# EAGLE design MUV_Sensors_pcb_all (EAGLE 9.1.3)

## Sheet 1 of 2
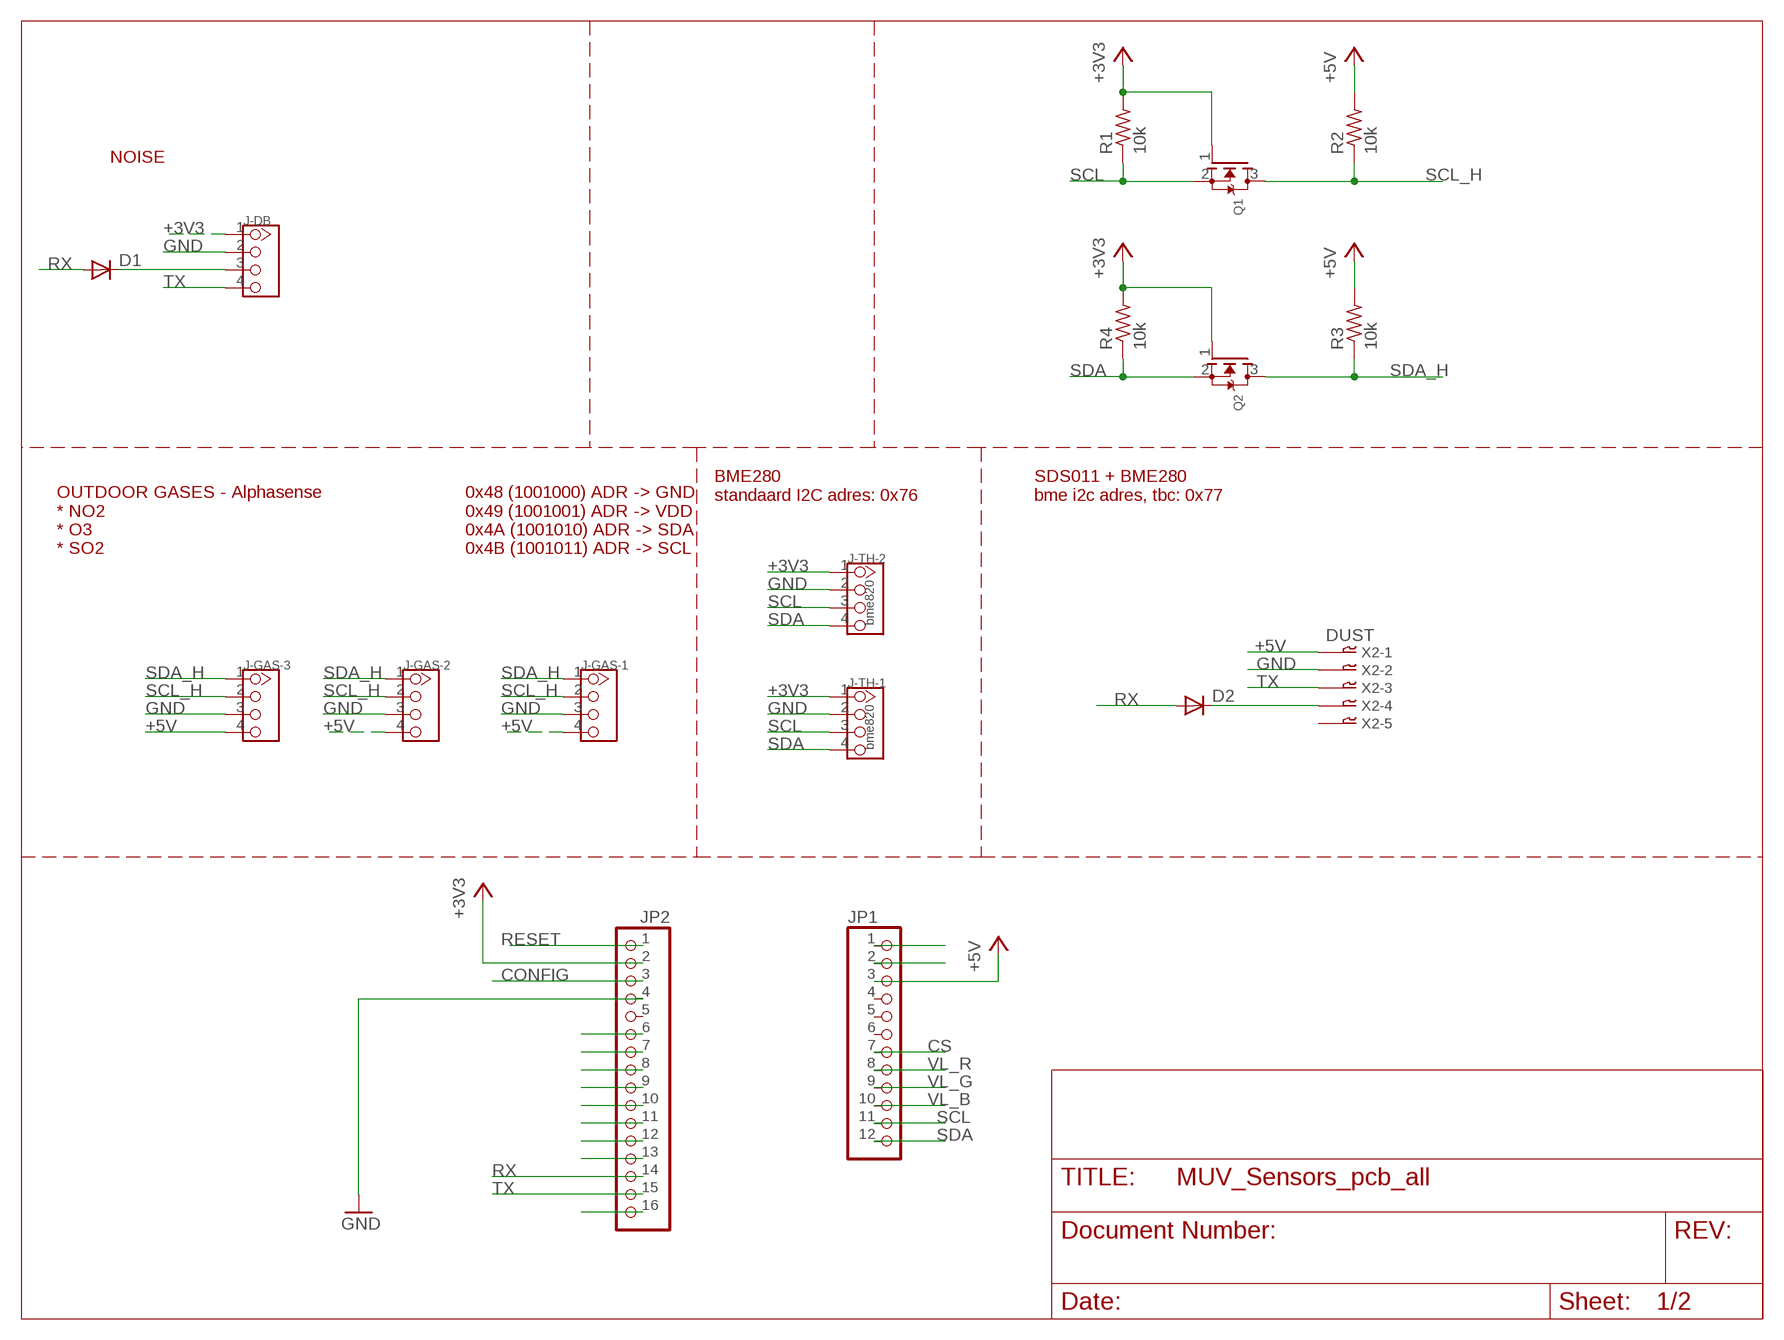
[diagram p0: schematic, sheet 1]

### Parts
D1  DIODE-DO214AA  [DO214AA]
D2  DIODE-DO214AA  [DO214AA]
J-DB  TWIG-4P-2.0-2.0  [4P-2.0]
J-GAS-1  TWIG-4P-2.0-2.0  [4P-2.0]
J-GAS-2  TWIG-4P-2.0-2.0  [4P-2.0]
J-GAS-3  TWIG-4P-2.0-2.0  [4P-2.0]
J-TH-1  bme820  TWIG-4P-2.0-2.0  [4P-2.0]
J-TH-2  bme820  TWIG-4P-2.0-2.0  [4P-2.0]
JP1  HEADER-1X12OVAL  [1X12_OVAL]
JP2  HEADER-1X16  [1X16_OVAL]
Q1  MOSFET-NWIDE  [SOT23-WIDE]
Q2  MOSFET-NWIDE  [SOT23-WIDE]
R1  10k  RESISTOR1206  [1206]
R2  10k  RESISTOR1206  [1206]
R3  10k  RESISTOR1206  [1206]
R4  10k  RESISTOR1206  [1206]
X2  DUST  05-JST-B5B-XH-A  [B5B-XH]

### Nets
+3V3 [power]: J-DB.1 J-TH-1.1 J-TH-2.1 JP2.2 Q1.1(G) Q2.1(G) R1.2 R4.2
+5V [power_5V]: J-GAS-1.4 J-GAS-2.4 J-GAS-3.4 JP1.3 R2.2 R3.2 X2.P$1
CONFIG: JP2.3
CS: JP1.7
GND [power]: J-DB.2 J-GAS-1.3 J-GAS-2.3 J-GAS-3.3 J-TH-1.2 J-TH-2.2 JP2.4 X2.P$2
N$1: JP1.1
N$2: JP1.2
N$3: D1.C J-DB.3
N$4: D2.C X2.P$4
N$13: JP2.6
N$14: JP2.7
N$17: JP2.8
N$18: JP2.9
N$19: JP2.10
N$20: JP2.11
N$21: JP2.12
N$22: JP2.13
N$23: JP2.16
RESET: JP2.1
RX: D1.A D2.A JP2.14
SCL: J-TH-1.3 J-TH-2.3 JP1.11 Q1.2(S) R1.1
SCL_H: J-GAS-1.2 J-GAS-2.2 J-GAS-3.2 Q1.3(D) R2.1
SDA: J-TH-1.4 J-TH-2.4 JP1.12 Q2.2(S) R4.1
SDA_H: J-GAS-1.1 J-GAS-2.1 J-GAS-3.1 Q2.3(D) R3.1
TX: J-DB.4 JP2.15 X2.P$3
VL_B: JP1.10
VL_G: JP1.9
VL_R: JP1.8
Unconnected: JP1.4 JP1.5 JP1.6 JP2.5 X2.P$5

### Notes on the sheet
- NOISE
- BME280
  standaard I2C adres: 0x76
- SDS011 + BME280
  bme i2c adres, tbc: 0x77
- OUTDOOR GASES - Alphasense
  * NO2
  * O3
  * SO2
- 0x48 (1001000) ADR -> GND
  0x49 (1001001) ADR -> VDD
  0x4A (1001010) ADR -> SDA
  0x4B (1001011) ADR -> SCL

## Sheet 2 of 2

## Library data of the parts
D1 D2 = diode:DIODE-: DIODE
J-DB J-GAS-1-J-GAS-3 J-TH-1 J-TH-2 = Connector:TWIG-4P-2.0
JP1 = headers:HEADER-1X12
JP2 = headers:HEADER-1X16: PIN HEADER
Q1 Q2 = microbuilder:MOSFET-N: N-Channel Mosfet LEGEND VDS: Voltage Drain-Source ID: Drain Current RDS(ON): Drain-Source On-State Resistance VGS(TH): Gate-Source Threshold Voltage CISS: Drain-Source Input Capacitance SOT-23 Name VDS ID RDS(ON) VGS(TH) CISS Order Number 2N7002E 60V 260mA 2.5 Ohm 2.5V @ 250uA 26.7pF @ 25V 2N7002ET1GOSTR-ND BSH103 30V 850mA 400 mOhm 400mV @ 1mA 83pF @ 24V BSH103,235-ND BSS138 60V 320mA 1.6 Ohm 1.5V @ 250uA 50pF @ 10V Mouser: 771-BSS138PW115 DMN2075U-7 20V 4.2A 38 mOhm 1V @ 250 uA 594.3pF @ 10V DMN2075U-7DICT-ND * BSS138 good choice for I2C level-shifting
R1-R4 = ng:RESISTOR
X2 = bt_con-jst-xh:05-JST: JST CONNECTOR

## Net classes
0 default: width 0.3 mm, clearance 0.4 mm
1 power: width 0.3 mm, clearance 0.4 mm
2 power_5V: width 1 mm

## Board
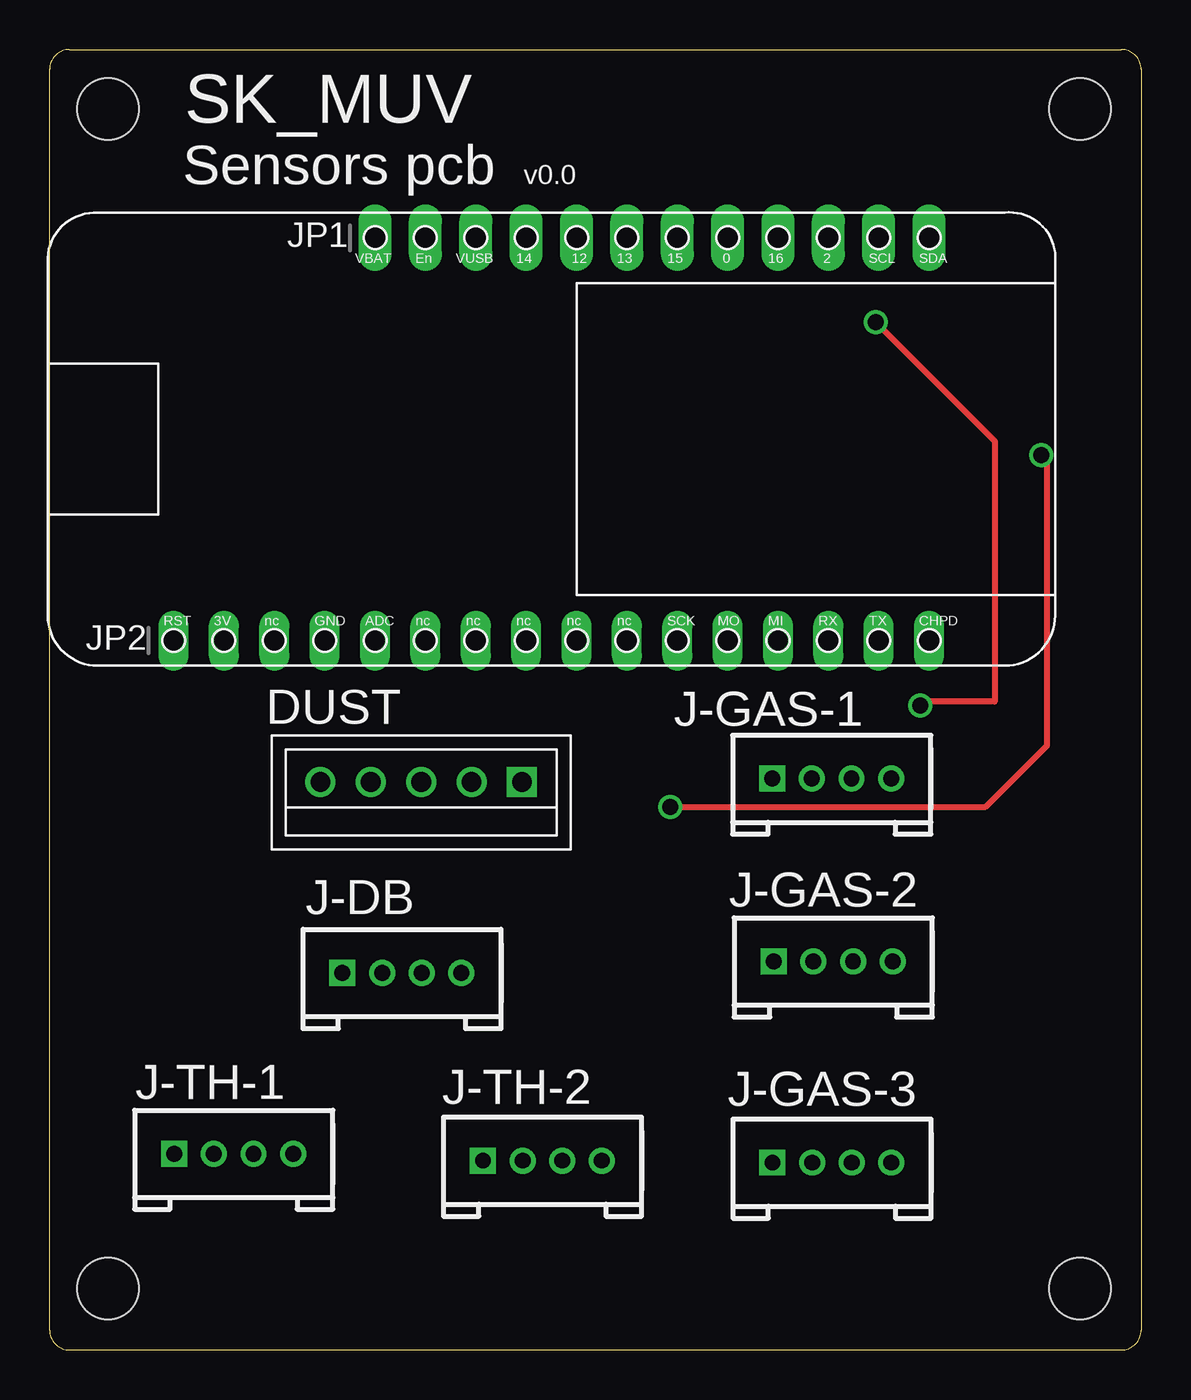
[diagram p1: board, top side]
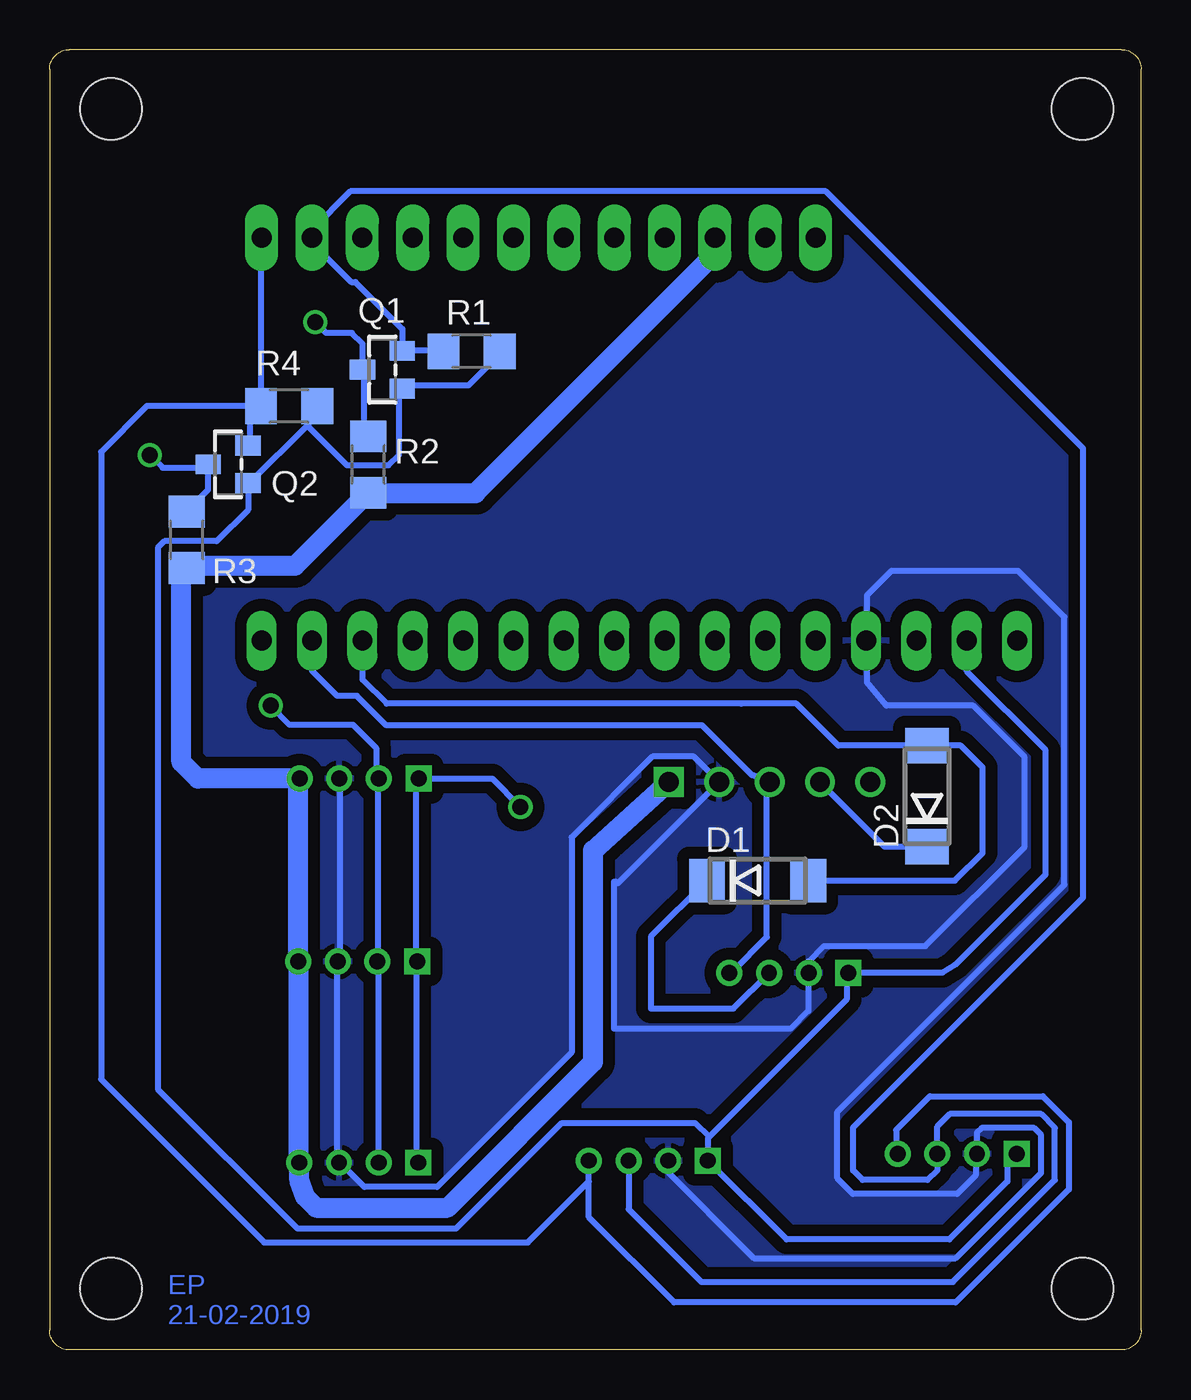
[diagram p2: board, bottom side, seen from below]

Size 55.05 x 65.6 mm. Coordinates in mm from the lower left corner, seen from the top.
Outline: 0,1 arc90 1,0 54.05,0 arc90 55.05,1 55.05,64.6 arc90 54.05,65.6 1,65.6 arc90 0,64.6 0,1
Copper layers (1*16): Top 0.035mm / dielectric 1.5mm / Bottom 0.035mm
Design rules "default *": minimum track width 6mil, minimum drill 0.35mm, track to track 0.4mm, track to pad 0.4mm, pad to pad 0.4mm, via to via 0.4mm, smd to smd 0.4mm, copper to edge 40mil, drill to drill 6mil, minimum pad ring 10mil, minimum via ring 8mil, stop-mask expansion 4mil, vias tented up to drill 0mil, thermal gap 10mil
Holes 3.1 mm at 2.95,62.6 51.95,62.6 51.95,3.1 2.95,3.1

### Footprints (pad centres in the part's own frame; a part is rotated, then mirrored left to right if it is on the bottom)
DO214AA = smd 1.8 x 2.2: A 2.55,0; C -2.55,0
4P-2.0 = drill 0.8 pad 1.27 square: 1 -3,0 | drill 0.8 pad 1.27: 2 -1,0; 3 1,0; 4 3,0
1X12_OVAL = drill 1.016 pad 1.676 long: 1 -13.97,0; 2 -11.43,0; 3 -8.89,0; 4 -6.35,0; 5 -3.81,0; 6 -1.27,0; 7 1.27,0; 8 3.81,0; 9 6.35,0; 10 8.89,0; 11 11.43,0; 12 13.97,0
1X16_OVAL = drill 1 long: 1 -19.05,0; 2 -16.51,0; 3 -13.97,0; 4 -11.43,0; 5 -8.89,0; 6 -6.35,0; 7 -3.81,0; 8 -1.27,0; 9 1.27,0; 10 3.81,0; 11 6.35,0; 12 8.89,0; 13 11.43,0; 14 13.97,0; 15 16.51,0; 16 19.05,0
SOT23-WIDE = smd 1 x 1.27: 1 -0.95,-1; 2 0.95,-1; 3 0,1
1206 = smd 1.6 x 1.803: 1 -1.422,0; 2 1.422,0
B5B-XH = drill 1 square: P$1 -5.08,0 | drill 1: P$2 -2.54,0; P$3 0,0; P$4 2.54,0; P$5 5.08,0

### Placement (x,y rotation side)
D1  19.34,23.68 0 bottom
D2  10.8,27.93 90 bottom
J-DB  17.77,19.02 0 top
J-GAS-1  39.44,28.82 0 top
J-GAS-2  39.52,19.6 0 top
J-GAS-3  39.45,9.45 0 top
J-TH-1  9.28,9.9 0 top
J-TH-2  24.85,9.55 0 top
JP1  30.38,56.1 0 top
JP2  25.3,35.78 0 top
Q1  38.27,49.45 90 bottom
Q2  46.04,44.68 90 bottom
R1  33.77,50.38 0 bottom
R2  38.98,44.66 270 bottom
R3  48.14,40.87 270 bottom
R4  42.97,47.62 0 bottom
U1  [ADA_FEATHER_HUZZAH_ESP8266_NOPADS]  -0.1,34.51 0 top
X2  18.74,28.65 180 top

### Tracks (layer width: path | path; a pad name or v marks a point on that pad's centre or on a via)
+3V3
  Bottom 0.3: 21.79,10.74 14.85,17.68 14.85,18.9 J-DB.1 10.03,19.02 9.38,19.42 4.82,23.98 4.82,30.26 8.79,34.23 JP2.2 | 21.79,10.74 21.85,10.68 J-TH-2.1 17.88,5.58 9.68,5.58 6.75,8.5 6.75,9.43 J-TH-1.1 | R1.2 32.35,50.23 33.93,48.65 37.25,48.65 Q1.1 37.43,48.48 37.43,45.15 37.95,44.63 40.05,44.63 42.07,46.64 | 42.07,46.64 41.63,47.08 41.63,47.6 R4.2 | 42.07,46.64 44.95,43.75 Q2.1 45.04,42.37 46.62,40.8 49.27,40.8 49.59,40.47 49.59,13.16 42.56,6.13 34.54,6.13 29.22,11.45 22.5,11.45 21.79,10.74
+5V
  Bottom 1: X2.P$1 27.63,25.2 27.63,14.52 34.98,7.18 41.6,7.18 42.16,7.73 42.45,8.55 J-GAS-3.4 42.5,9.45 42.5,19.6 J-GAS-2.4 42.5,19.95 42.5,28.7 J-GAS-1.4 47.57,28.82 48.4,29.65 48.4,39.55 48.1,39.55 | 48.1,39.55 R3.2 | JP1.3 21.5,56 21.5,55.3 33.58,43.23 38.48,43.23 R2.2 39,43.23 42.68,39.55 48.1,39.55
GND
  Bottom 0.3: J-GAS-1.3 40.4,28.7 40.4,19.6 J-GAS-2.3 40.58,19.6 40.58,9.45 J-GAS-3.3 40.4,9.45 39.18,8.23 35.5,8.23 28.72,15.01 28.72,25.86 24.65,29.93 22.55,29.93 21.33,28.7 X2.P$2 26.38,23.55 26.58,23.63 26.58,16.2 17.68,16.2 16.78,17.1 16.78,18.9 J-DB.2 16.77,19.61 16,20.38 10.89,20.38 5.88,25.39 5.88,25.47 5.88,26.02 5.88,29.91 8.48,32.51 12.85,32.51 13.84,33.69 13.84,35.74 | 23.95,9.63 J-TH-2.2 24.15,9.25 19.53,4.63 9.35,4.63 5.05,8.93 5.05,10.85 5.4,11.2 8.05,11.2 8.28,10.97 J-TH-1.2 8.35,9.83 8.35,8.8 9.28,7.88 14.54,7.88 15.33,8.66 15.33,12.02 3.88,23.47 3.88,36.98 6.2,39.3 12.6,39.3 13.84,38.06 13.84,35.74 | 13.84,35.74 JP2.4
  pour Bottom (isolate 0.6): 2.95,4.6 5.65,1.9 49.75,1.9 50.95,1.9 53.85,4.8 53.85,60.7 50.55,64 4.45,64 1.25,60.8 1.25,6.3
N$3
  Bottom 0.3: J-DB.3 20.57,17.22 24.72,17.22 24.72,20.85 D1.C
N$4
  Bottom 0.3: D2.C 12.93,25.38 X2.P$4
RX
  Bottom 0.3: JP2.14 39.27,33.82 38.05,32.6 20.19,32.6 20.15,32.6 17.39,32.6 15.27,30.48 D2.A 9.09,30.48 8,29.39 8,25.07 9.39,23.68 D1.A
SCL
  Bottom 0.3: 37.25,50.4 35.33,50.4 R1.1 | 37.25,50.4 Q1.2 | 37.25,50.4 37.25,51.5 39.63,53.88 39.85,53.88 41.81,55.84 JP1.11 41.8,56.18 41.8,56.53 39.88,58.45 15.9,58.45 2.93,45.48 2.93,22.83 14.53,11.23 14.53,9.05 14.05,8.58 10.78,8.58 10.28,9.07 J-TH-1.3 10.28,11.27 9.65,11.9 5.05,11.9 4.35,11.2 4.35,8.58 9.5,3.43 22.18,3.43 25.85,7.1 J-TH-2.3
SCL_H  (via drill 0.81)
  Top 0.3: v41.65,51.85 47.65,45.85 47.65,32.7 44.1,32.7 v43.9,32.5
  Bottom 0.3: Q1.3 39.18,49.35 39.18,46.38 39,46.2 R2.1 | 38.48,19.6 38.48,9.45 J-GAS-3.2 | 38.48,19.6 38.48,28.7 | 38.48,28.7 38.58,28.38 38.58,30.38 39.75,31.55 42.95,31.55 v43.9,32.5 | 38.48,19.6 J-GAS-2.2 | 39.35,49.35 Q1.3 | 38.48,28.88 J-GAS-1.2 38.48,28.7 | Q1.3 39.27,50.76 39.8,51.3 41.1,51.3 v41.65,51.85
SDA
  Bottom 0.3: Q2.2 44.95,45.68 44.95,47.08 44.43,47.6 R4.1 | 27.85,8.5 30.93,5.43 44.23,5.43 52.45,13.65 52.45,45.3 50.14,47.62 R4.1 | 27.85,8.5 J-TH-2.4 | JP1.12 44.39,56.07 R4.1 | 27.85,8.5 27.85,6.7 23.55,2.4 9.35,2.4 3.65,8.1 3.65,11.49 4.96,12.8 10.65,12.8 12.35,11.1 12.35,9.97 J-TH-1.4
SDA_H  (via drill 0.81)
  Top 0.3: v31.3,27.4 47.2,27.4 50.3,30.5 50.3,44.85 v50,45.15
  Bottom 0.3: 36.55,19.6 36.55,9.45 J-GAS-3.1 | 36.55,19.6 36.55,28.7 J-GAS-1.1 32.72,28.82 v31.3,27.4 | 36.55,19.6 J-GAS-2.1 | 47.05,44.5 47.05,43.4 48.1,42.35 R3.1 | 47.05,44.5 47.05,44.63 Q2.3 | v50,45.15 49.35,44.5 47.05,44.5
TX
  Bottom 0.3: J-DB.4 20.63,19.08 18.88,20.83 18.88,28.53 X2.P$3 19.63,28.99 22.15,31.51 38.06,31.51 39.55,33 40.55,33 41.81,34.26 JP2.15 41.8,35.7

### Text on the board
Bottom: EP / 21-02-2019
tPlace: SK_MUV | Sensors pcb | v0.0